# EAGLE design Arduino_Shield_1_19_19_REV0 (EAGLE 9.2.2)
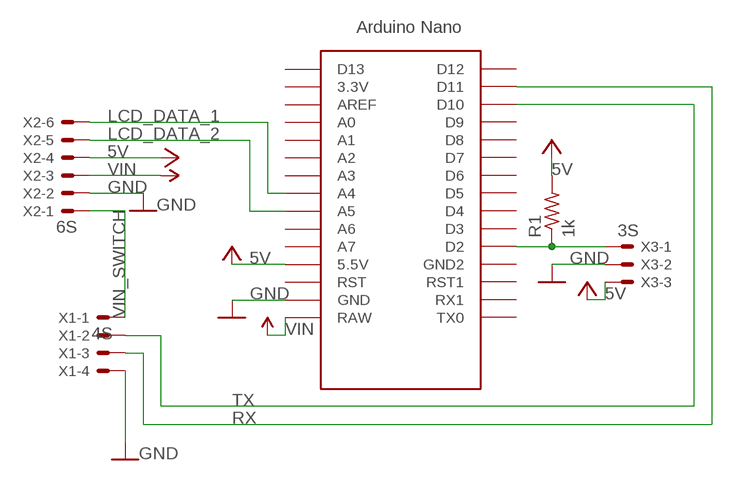
[diagram p0: schematic, sheet 1]

## Parts
R1  1k  R-US_R0805  [R0805]
U$1  NANO  [NANO]
X1  4S  JST-XH-04-PIN-ROUND-PAD  [JST-XH-04-PACKAGE-ROUND-PAD]
X2  6S  JST-XH-06-PIN-ROUND-PAD  [JST-XH-06-PACKAGE-ROUND-PAD]
X3  3S  JST-XH-03-PIN-ROUND-PAD  [JST-XH-03-PACKAGE-ROUND-PAD]

## Nets
5V: R1.2 U$1.5V(5.5V) X2.4 X3.3 ; supply symbol labelled VCC
GND: U$1.GND X1.4 X2.2 X3.2
LCD_DATA_1: U$1.A4 X2.6
LCD_DATA_2: U$1.A5 X2.5
N$4: R1.1 U$1.D2 X3.1
RX: U$1.D11 X1.3
TX: U$1.D10 X1.2
VIN: U$1.RAW X2.3
VIN_SWITCH: X1.1 X2.1
Unconnected: U$1.3.3V U$1.A0 U$1.A1 U$1.A2 U$1.A3 U$1.A6 U$1.A7 U$1.AREF U$1.D3 U$1.D4 U$1.D5 U$1.D6 U$1.D7 U$1.D8 U$1.D9 U$1.D12 U$1.D13 U$1.GND1(GND2) U$1.ICSP1 U$1.ICSP2 U$1.ICSP3 U$1.ICSP4 U$1.ICSP5 U$1.ICSP6 U$1.RST U$1.RST1 U$1.RX1 U$1.TX0

## Library data of the parts
R1 = adafruit:R-US_: RESISTOR, American symbol
U$1 = Arduino-clone:NANO: Arduino Nano
X1 = Rembrandt Electronics - JST XH Connectors v1-0:JST-XH-04-PIN: JST XH Connector 2 Pin Wire to board connector. Pitch: 2,54 mm, (0.100") Number of pins: 4 Created by Rembrandt Electronics www.rembrandtelectronics.com
X2 = Rembrandt Electronics - JST XH Connectors v1-0:JST-XH-06-PIN: JST XH Connector 2 Pin Wire to board connector. Pitch: 2,54 mm, (0.100") Number of pins: 6 Created by Rembrandt Electronics www.rembrandtelectronics.com
X3 = Rembrandt Electronics - JST XH Connectors v1-0:JST-XH-03-PIN: JST XH Connector 2 Pin Wire to board connector. Pitch: 2,54 mm, (0.100") Number of pins: 3 Created by Rembrandt Electronics www.rembrandtelectronics.com

## Net classes
0 default: width 0.305 mm, clearance 0.254 mm

## Board
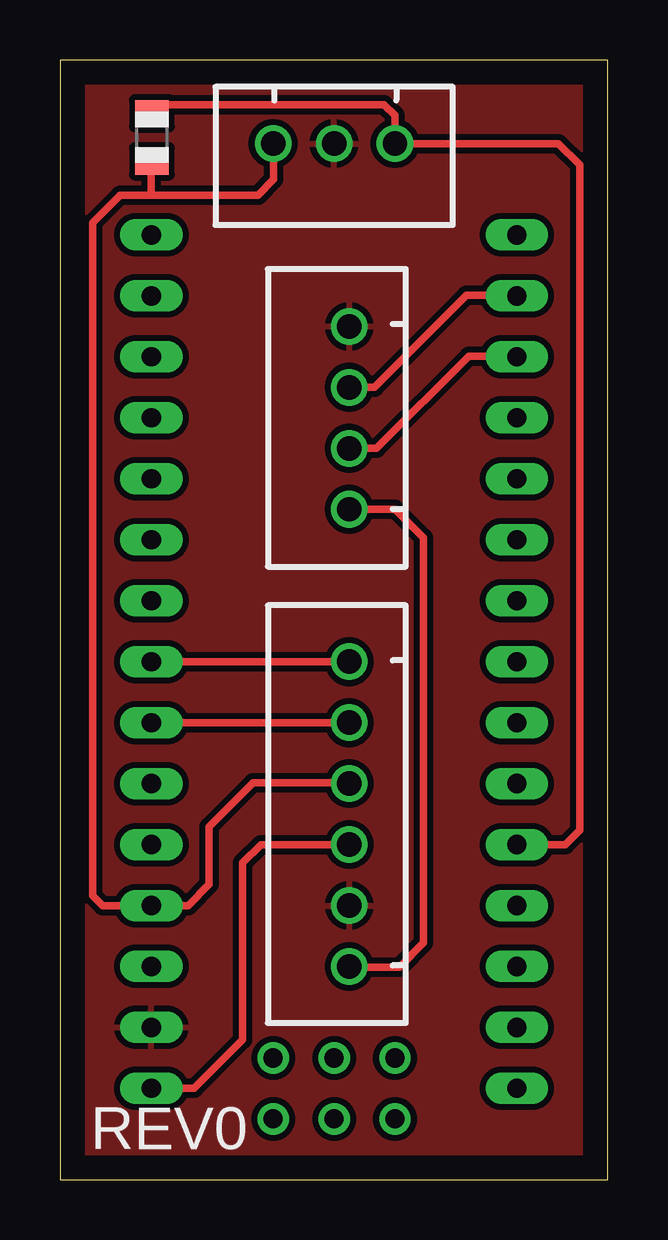
[diagram p1: board, top side]
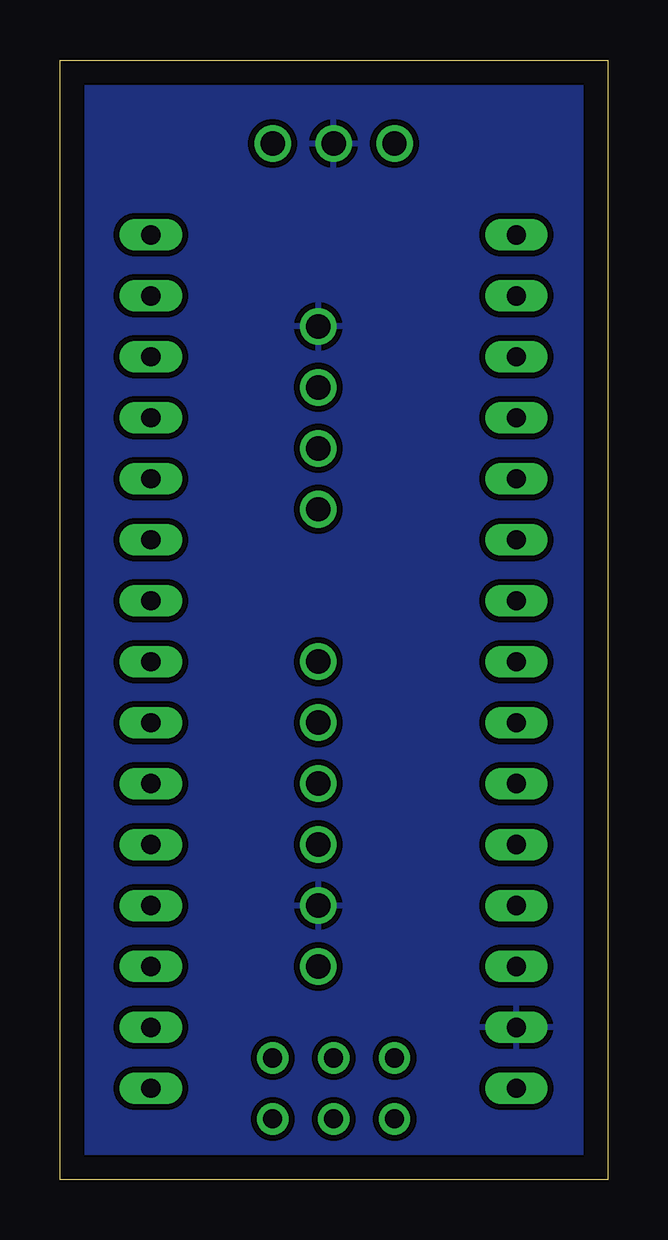
[diagram p2: board, bottom side, seen from below]

Size 22.84 x 46.66 mm. Coordinates in mm from the lower left corner, seen from the top.
Outline: 0,0 22.84,0 22.84,46.66 0,46.66 0,0
Copper layers (1*16): Top 0.035mm / dielectric 1.5mm / Bottom 0.035mm
Design rules "default": minimum track width 6mil, minimum drill 0.35mm, track to track 6mil, track to pad 6mil, pad to pad 6mil, via to via 6mil, smd to smd 6mil, copper to edge 40mil, drill to drill 6mil, minimum pad ring 10mil, minimum via ring 8mil, stop-mask expansion 4mil, vias tented up to drill 0mil, thermal gap 10mil

### Footprints (pad centres in the part's own frame; a part is rotated, then mirrored left to right if it is on the bottom)
R0805 = smd 1.1 x 1.4: 1 -1,0; 2 1,0
NANO = drill 0.8 long: 3.3V -10.16,24.13; 5V -10.16,-1.27; A0 -10.16,19.05; A1 -10.16,16.51; A2 -10.16,13.97; A3 -10.16,11.43; A4 -10.16,8.89; A5 -10.16,6.35; A6 -10.16,3.81; A7 -10.16,1.27; AREF -10.16,21.59; D2 5.08,1.27; D3 5.08,3.81; D4 5.08,6.35; D5 5.08,8.89; D6 5.08,11.43; D7 5.08,13.97; D8 5.08,16.51; D9 5.08,19.05; D10 5.08,21.59; D11 5.08,24.13; D12 5.08,26.67; D13 -10.16,26.67; GND -10.16,-6.35; GND1 5.08,-1.27; RAW -10.16,-8.89; RST -10.16,-3.81; RST1 5.08,-3.81; RX1 5.08,-6.35; TX0 5.08,-8.89 | drill 0.8: ICSP1 -5.08,-10.16; ICSP2 -5.08,-7.62; ICSP3 -2.54,-10.16; ICSP4 -2.54,-7.62; ICSP5 0,-10.16; ICSP6 0,-7.62
JST-XH-04-PACKAGE-ROUND-PAD = drill 1.016: 1 -3.81,0; 2 -1.27,0; 3 1.27,0; 4 3.81,0
JST-XH-06-PACKAGE-ROUND-PAD = drill 1.016: 1 -6.35,0; 2 -3.81,0; 3 -1.27,0; 4 1.27,0; 5 3.81,0; 6 6.35,0
JST-XH-03-PACKAGE-ROUND-PAD = drill 1.016: 1 -2.54,0; 2 0,0; 3 2.54,0

### Placement (x,y rotation side)
R1  3.84,43.43 270 top
U$1  13.97,12.7 0 top
X1  12.06,31.75 90 top
X2  12.06,15.24 90 top
X3  11.43,43.18 180 top

### Tracks (layer width: path | path; a pad name or v marks a point on that pad's centre or on a via)
5V
  Top 0.305: X2.4 12.04,16.54 8.05,16.54 6.22,14.71 6.22,12.32 5.33,11.43 U$1.5V 1.78,11.43 1.37,11.84 1.37,39.88 2.52,41.02 3.81,41.02 | 3.81,41.02 8.26,41.02 8.91,41.68 8.91,43.16 X3.3 | R1.2 3.81,42.41 3.81,41.02
GND
  pour Top: -0.64,46.99 23.5,46.99 23.5,-0.64 -0.64,-0.64
  pour Bottom: 1.02,45.85 1.02,0.76 21.97,0.76 21.97,45.85
LCD_DATA_1
  Top 0.305: X2.6 U$1.A4
LCD_DATA_2
  Top 0.305: U$1.A5 X2.5
N$4
  Top 0.305: U$1.D2 21.08,13.97 21.67,14.56 21.67,42.29 20.78,43.18 X3.1 13.97,44.35 13.51,44.81 4.21,44.81 R1.1
RX
  Top 0.305: X1.3 13.11,33.02 16.94,36.85 19.02,36.85 U$1.D11
TX
  Top 0.305: X1.2 13.21,30.48 17.04,34.31 19.02,34.31 U$1.D10
VIN
  Top 0.305: X2.3 8.38,13.97 7.62,13.21 7.62,5.84 5.59,3.81 U$1.RAW
VIN_SWITCH
  Top 0.305: X2.1 12.09,8.87 14.15,8.87 15.16,9.88 15.16,26.75 13.97,27.94 X1.1

### Text on the board
tNames: REV0